# Altium project VerticalStrip.PrjPcb
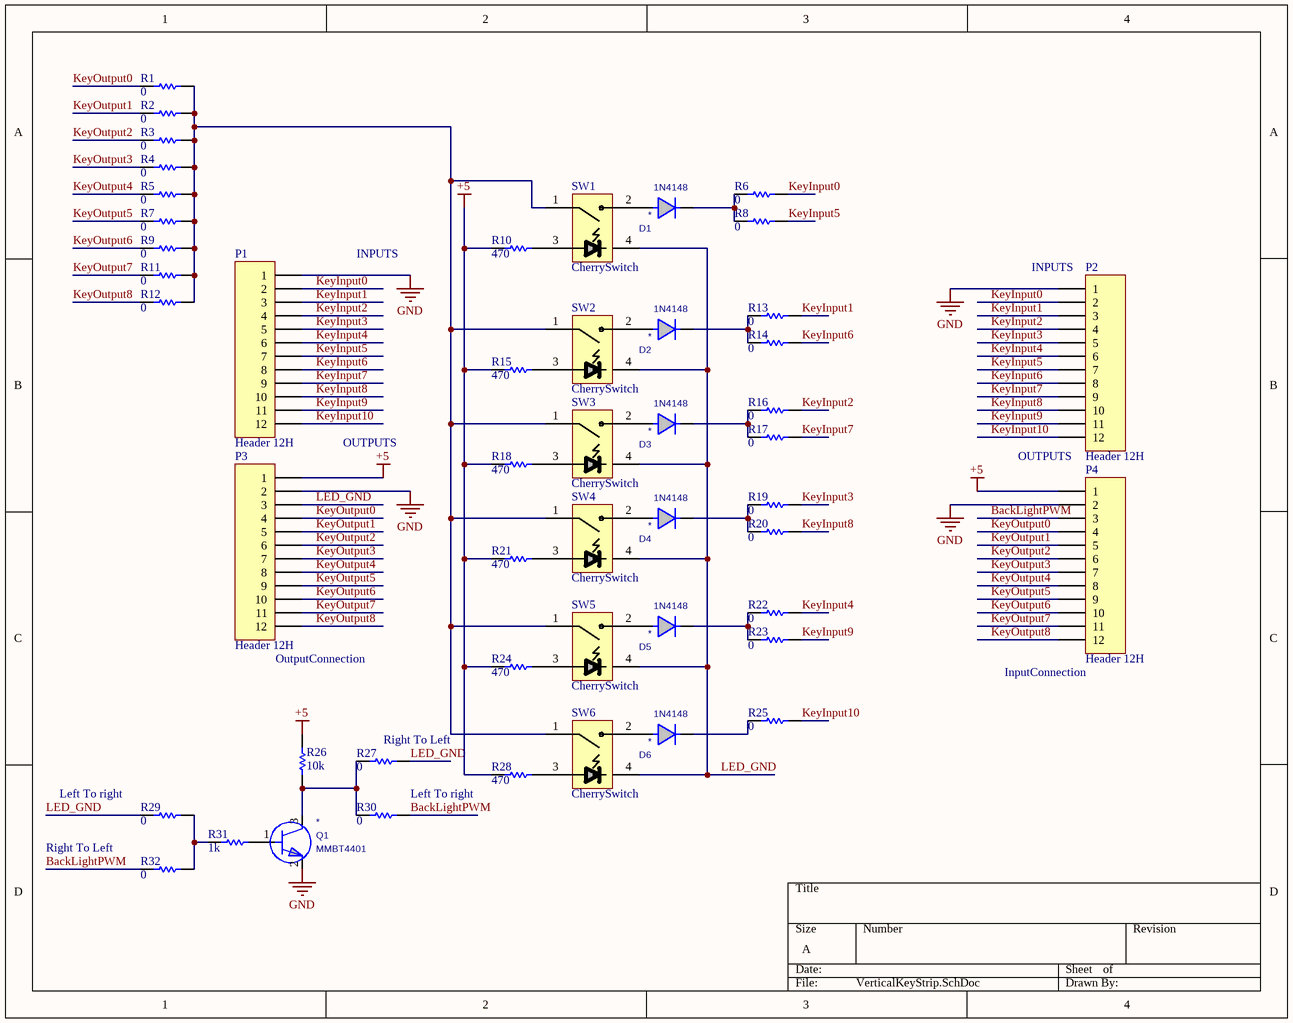
[diagram p0: VerticalKeyStrip.SchDoc]
1 sheet, 49 parts. Net scope: global (net labels, ports and power ports of the same name join across sheets).
Board file: VerticalKeyStrip.PcbDoc

## Sheet VerticalKeyStrip.SchDoc
size A

### Parts
D1  1N4148  [DIODE400/60/32]
D2  1N4148  [DIODE400/60/32]
D3  1N4148  [DIODE400/60/32]
D4  1N4148  [DIODE400/60/32]
D5  1N4148  [DIODE400/60/32]
D6  1N4148  [DIODE400/60/32]
P1  Header 12H  [HDR1X12H]
P2  Header 12H  [HDR1X12H]
P3  Header 12H  [HDR1X12H]
P4  Header 12H  [HDR1X12H]
Q1  value MMBT4401  [SOT23-3]  (hidden comment: NPN_TRANSISTOR)
R1  value 0  [RESC2012L]  (hidden comment: Res Semi)
R2  value 0  [RESC2012L]  (hidden comment: Res Semi)
R3  value 0  [RESC2012L]  (hidden comment: Res Semi)
R4  value 0  [RESC2012L]  (hidden comment: Res Semi)
R5  value 0  [RESC2012L]  (hidden comment: Res Semi)
R6  value 0  [RESC2012L]  (hidden comment: Res Semi)
R7  value 0  [RESC2012L]  (hidden comment: Res Semi)
R8  value 0  [RESC2012L]  (hidden comment: Res Semi)
R9  value 0  [RESC2012L]  (hidden comment: Res Semi)
R10  value 470  [RESC2012L]  (hidden comment: Res Semi)
R11  value 0  [RESC2012L]  (hidden comment: Res Semi)
R12  value 0  [RESC2012L]  (hidden comment: Res Semi)
R13  value 0  [RESC2012L]  (hidden comment: Res Semi)
R14  value 0  [RESC2012L]  (hidden comment: Res Semi)
R15  value 470  [RESC2012L]  (hidden comment: Res Semi)
R16  value 0  [RESC2012L]  (hidden comment: Res Semi)
R17  value 0  [RESC2012L]  (hidden comment: Res Semi)
R18  value 470  [RESC2012L]  (hidden comment: Res Semi)
R19  value 0  [RESC2012L]  (hidden comment: Res Semi)
R20  value 0  [RESC2012L]  (hidden comment: Res Semi)
R21  value 470  [RESC2012L]  (hidden comment: Res Semi)
R22  value 0  [RESC2012L]  (hidden comment: Res Semi)
R23  value 0  [RESC2012L]  (hidden comment: Res Semi)
R24  value 470  [RESC2012L]  (hidden comment: Res Semi)
R25  value 0  [RESC2012L]  (hidden comment: Res Semi)
R26  value 10k  [RESC2012L]  (hidden comment: Res Semi)
R27  value 0  [RESC2012L]  (hidden comment: Res Semi)
R28  value 470  [RESC2012L]  (hidden comment: Res Semi)
R29  value 0  [RESC2012L]  (hidden comment: Res Semi)
R30  value 0  [RESC2012L]  (hidden comment: Res Semi)
R31  value 1k  [RESC2012L]  (hidden comment: Res Semi)
R32  value 0  [RESC2012L]  (hidden comment: Res Semi)
SW1  CherrySwitch  [CherryMxSwitch]
SW2  CherrySwitch  [CherryMxSwitch]
SW3  CherrySwitch  [CherryMxSwitch]
SW4  CherrySwitch  [CherryMxSwitch]
SW5  CherrySwitch  [CherryMxSwitch]
SW6  CherrySwitch  [CherryMxSwitch]

### Nets
+5: P3.1 P4.1 R10.1 R15.1 R18.1 R21.1 R24.1 R26.2 R28.1
GND: P1.1 P2.1 P3.2 P4.2 Q1.2(emitter)
BackLightPWM: P4.3 R30.2 R32.1
KeyInput0: P1.2 P2.2 R6.2
KeyInput1: P1.3 P2.3 R13.2
KeyInput2: P1.4 P2.4 R16.2
KeyInput3: P1.5 P2.5 R19.2
KeyInput4: P1.6 P2.6 R22.2
KeyInput5: P1.7 P2.7 R8.2
KeyInput6: P1.8 P2.8 R14.2
KeyInput7: P1.9 P2.9 R17.2
KeyInput8: P1.10 P2.10 R20.2
KeyInput9: P1.11 P2.11 R23.2
KeyInput10: P1.12 P2.12 R25.2
KeyOutput0: P3.4 P4.4 R1.1
KeyOutput1: P3.5 P4.5 R2.1
KeyOutput2: P3.6 P4.6 R3.1
KeyOutput3: P3.7 P4.7 R4.1
KeyOutput4: P3.8 P4.8 R5.1
KeyOutput5: P3.9 P4.9 R7.1
KeyOutput6: P3.10 P4.10 R9.1
KeyOutput7: P3.11 P4.11 R11.1
KeyOutput8: P3.12 P4.12 R12.1
LED_GND: P3.3 R27.2 R29.1 SW1.4 SW2.4 SW3.4 SW4.4 SW5.4 SW6.4
NetD1_1: D1.1(CATHODE) R6.1 R8.1
NetD1_2: D1.2(ANODE) SW1.2
NetD2_1: D2.1(CATHODE) R13.1 R14.1
NetD2_2: D2.2(ANODE) SW2.2
NetD3_1: D3.1(CATHODE) R16.1 R17.1
NetD3_2: D3.2(ANODE) SW3.2
NetD4_1: D4.1(CATHODE) R19.1 R20.1
NetD4_2: D4.2(ANODE) SW4.2
NetD5_1: D5.1(CATHODE) R22.1 R23.1
NetD5_2: D5.2(ANODE) SW5.2
NetD6_1: D6.1(CATHODE) R25.1
NetD6_2: D6.2(ANODE) SW6.2
NetQ1_1: Q1.1(base) R31.2
NetQ1_3: Q1.3(collector) R26.1 R27.1 R30.1
NetR1_2: R1.2 R2.2 R3.2 R4.2 R5.2 R7.2 R9.2 R11.2 R12.2 SW1.1 SW2.1 SW3.1 SW4.1 SW5.1 SW6.1
NetR10_2: R10.2 SW1.3
NetR15_2: R15.2 SW2.3
NetR18_2: R18.2 SW3.3
NetR21_2: R21.2 SW4.3
NetR24_2: R24.2 SW5.3
NetR28_2: R28.2 SW6.3
NetR29_2: R29.2 R31.1 R32.2

### Notes on the sheet
- INPUTS
- (near P2) INPUTS
- OUTPUTS
- (near P3) OutputConnection
- (near P4) InputConnection
- (near R27) Right To Left
- (near R29) Left To right
- Left To right
- Right To Left

### Library data of the parts
D1-D6 = 5283: Diode, 1N4148, 75V, 0.4 in., DO-35, 150mA, Switching, 500mW, Any; LeadSpacing: 0.4 in.; Reference: g:\accel_lib\datasheets\1N914-916-4148-Fairchild.PDF; plIDX: 5283; DNS: *; Value: 1N4148; Package: DO-35; Wattage: 500mW; Vendor: Any; DiodeType: Switching; Voltage: 75V; Amperage: 150mA; CheckedBy: B. Lyon; ModifyDate: 08/27/2007 16:11:30; ComponentType: Diode; Cost: 0.0038; ComponentLink4URL: https://pdm.iconfitness.com/PDM/EBOM/PartsMaintenance/PartsMaintenance.aspx?Editplidx=5283; ComponentLink4Description: PDM Parts Maintenance
P1-P4 = Header 12H: Header, 12-Pin, Right Angle; LatestRevisionDate: 17-Jul-2002; LatestRevisionNote: Re-released for DXP Platform.; Publisher: Altium Limited
Q1 = 265442: Transistor, MMBT4401, 40V, SOT23-3, 500mA, NPN, Transistor, On Semi: MMBT4401LT1; plIDX: 265442; CheckedBy: gdeguzman; DNS: *; ComponentType: Transistor; CreatedBy: Mike Tyger; LastUpdatedBy: Mike Tyger; Cost: 0.0094; Voltage: 40V; Package: SOT23-3; Amperage: 500mA; TransistorType: NPN; ChipType: Transistor; Vendor: On Semi: MMBT4401LT1; ComponentLink4URL: https://pdm.iconfitness.com/PDM/EBOM/PartsMaintenance/PartsMaintenance.aspx?Editplidx=265442; ComponentLink4Description: PDM Parts Maintenance
R1-R32 = Res Semi: Semiconductor Resistor; Published: 8-Jun-2000; LatestRevisionDate: 17-Jul-2002; LatestRevisionNote: Re-released for DXP Platform.; PackageReference: AXIAL-0.5; Publisher: Altium Limited
SW1-SW6 = CherrySwitch: Cherry MX Switch layout